# Altium schematic sheet Power.SchDoc
size A4; SheetNumber: 7; SheetTotal: 7
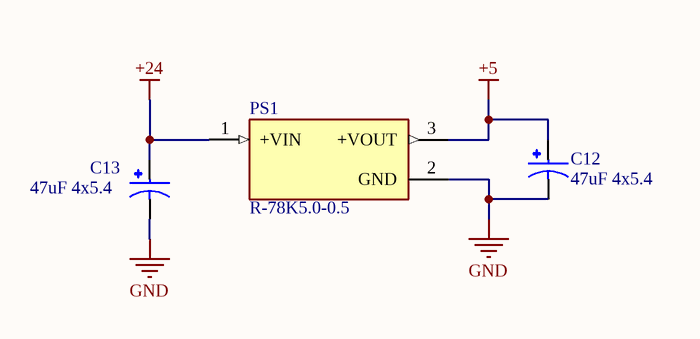
[diagram p0: Power.SchDoc]

## Parts
C12  47uF 4x5.4  [Electrolytic 4x5.4]
C13  47uF 4x5.4  [Electrolytic 4x5.4]
PS1  R-78K5.0-0.5  [CONV_R-78K5.0-0.5]

## Nets
+5: C12.1 PS1.3(+VOUT)
+24: C13.1 PS1.1(+VIN)
GND: C12.2 C13.2 PS1.2(GND)

## Library data of the parts
C12 C13 = Electrolytic 4x5.4: MF: Panasonic; MP: EEE-HA1E100WR; Package: RADIAL-2 Panasonic; Check_prices: https://www.snapeda.com/parts/EEE-HA1E100WR/Panasonic/view-part/778519/?ref=eda; Value: *; Price: None; Purchase-URL: https://pricing.snapeda.com/search/part/EEE-HA1E100WR/?ref=eda; SnapEDA_Link: https://www.snapeda.com/parts/EEE-HA1E100WR/Panasonic/view-part/778519/?ref=snap; Availability: In Stock
PS1 = R-78K5.0-0.5: 0.5A DC/DC-Converter 'INNOLINE' SIP3 reg; MF: Recom Power; Package: None; Value: *; Check_prices: https://www.snapeda.com/parts/R-78K5.0-0.5/Recom+Power/view-part/?ref=eda; Purchase-URL: https://pricing.snapeda.com/search/part/R-78K5.0-0.5/?ref=eda; Availability: In Stock; SnapEDA_Link: https://www.snapeda.com/parts/R-78K5.0-0.5/Recom+Power/view-part/?ref=snap; Price: None; MP: R-78K5.0-0.5